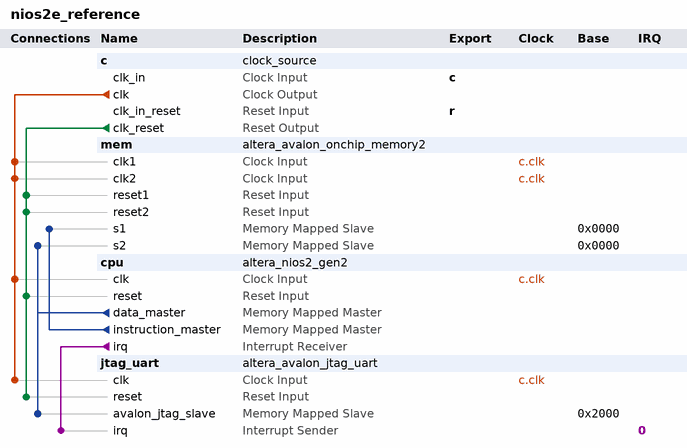
[diagram p0: system contents]
# Platform Designer (Qsys) system nios2e_reference, Cyclone 10 LP 10CL006YE144C8G
# Parameters at their usual value, and those the tool derives, are not listed.
package require -exact qsys 17.1
create_system nios2e_reference
set_project_property DEVICE_FAMILY {Cyclone 10 LP}
set_project_property DEVICE 10CL006YE144C8G

add_instance c clock_source 17.1
set_instance_parameter_value c clockFrequency 125000000

add_instance mem altera_avalon_onchip_memory2 17.1
set_instance_parameter_value mem dataWidth 32
set_instance_parameter_value mem dualPort true
set_instance_parameter_value mem initMemContent true
set_instance_parameter_value mem initializationFileName onchip_mem.hex
set_instance_parameter_value mem memorySize 8192

add_instance cpu altera_nios2_gen2 17.1
set_instance_parameter_value cpu dcache_size 2048
set_instance_parameter_value cpu debug_enabled false
set_instance_parameter_value cpu exceptionOffset 64
set_instance_parameter_value cpu exceptionSlave mem.s1
set_instance_parameter_value cpu icache_size 4096
set_instance_parameter_value cpu impl Tiny
set_instance_parameter_value cpu resetOffset 32
set_instance_parameter_value cpu resetSlave mem.s1
set_instance_parameter_value cpu resetrequest_enabled false

add_instance jtag_uart altera_avalon_jtag_uart 17.1
set_instance_parameter_value jtag_uart readBufferDepth 8
set_instance_parameter_value jtag_uart readIRQThreshold 4
set_instance_parameter_value jtag_uart simInteractiveOptions NO_INTERACTIVE_WINDOWS
set_instance_parameter_value jtag_uart useRegistersForReadBuffer true
set_instance_parameter_value jtag_uart useRegistersForWriteBuffer true
set_instance_parameter_value jtag_uart writeBufferDepth 8
set_instance_parameter_value jtag_uart writeIRQThreshold 4

# connections
add_connection c.clk cpu.clk clock
add_connection c.clk jtag_uart.clk clock
add_connection c.clk mem.clk1 clock
add_connection c.clk mem.clk2 clock
add_connection c.clk_reset cpu.reset reset
add_connection c.clk_reset jtag_uart.reset reset
add_connection c.clk_reset mem.reset1 reset
add_connection c.clk_reset mem.reset2 reset
add_connection cpu.data_master jtag_uart.avalon_jtag_slave avalon
set_connection_parameter_value cpu.data_master/jtag_uart.avalon_jtag_slave baseAddress 0x2000
add_connection cpu.data_master mem.s2 avalon
set_connection_parameter_value cpu.data_master/mem.s2 baseAddress 0x0000
add_connection cpu.instruction_master mem.s1 avalon
set_connection_parameter_value cpu.instruction_master/mem.s1 baseAddress 0x0000
add_connection cpu.irq jtag_uart.irq interrupt
set_connection_parameter_value cpu.irq/jtag_uart.irq irqNumber 0

# exported interfaces
add_interface c clock sink
set_interface_property c EXPORT_OF c.clk_in
add_interface r reset sink
set_interface_property r EXPORT_OF c.clk_in_reset

set_interconnect_requirement {$system} qsys_mm.clockCrossingAdapter HANDSHAKE
set_interconnect_requirement {$system} qsys_mm.enableEccProtection FALSE
set_interconnect_requirement {$system} qsys_mm.insertDefaultSlave FALSE
set_interconnect_requirement {$system} qsys_mm.maxAdditionalLatency 1

save_system nios2e_reference.qsys
